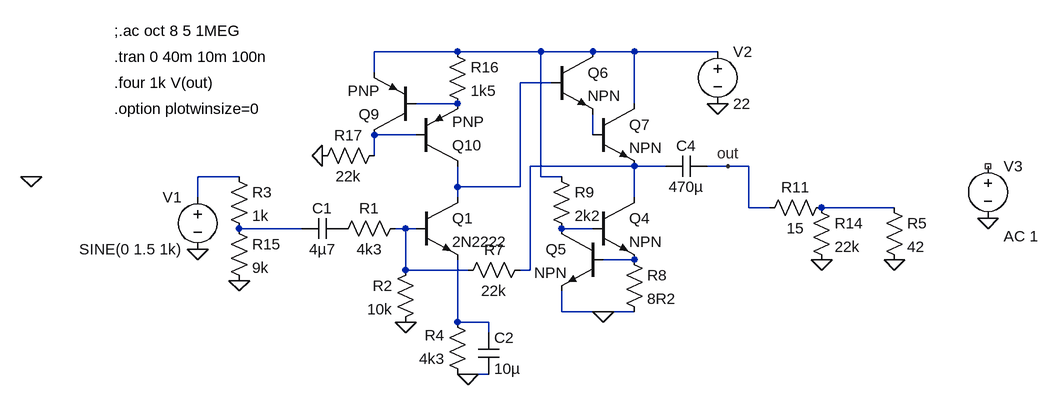
[diagram p0: schematic self_vas_2.asc]
self_vas_2.asc, the LTspice schematic file:
Version 4
SHEET 1 2004 740
WIRE 720 -16 592 -16
WIRE 848 -16 720 -16
WIRE 928 -16 848 -16
WIRE 992 -16 928 -16
WIRE 1120 -16 992 -16
WIRE 592 16 592 -16
WIRE 864 32 816 32
WIRE 720 64 656 64
WIRE 992 64 992 -16
WIRE 656 112 592 112
WIRE 928 112 928 80
WIRE 592 144 592 112
WIRE 992 160 832 160
WIRE 1040 160 992 160
WIRE 1136 160 1104 160
WIRE 1168 160 1136 160
WIRE 384 176 320 176
WIRE 848 176 848 -16
WIRE 880 176 848 176
WIRE 720 192 720 160
WIRE 816 192 816 32
WIRE 816 192 720 192
WIRE 320 208 320 176
WIRE 720 208 720 192
WIRE 992 208 992 160
WIRE 1168 224 1168 160
WIRE 1200 224 1168 224
WIRE 1392 224 1280 224
WIRE 480 256 384 256
WIRE 640 256 624 256
WIRE 656 256 640 256
WIRE 928 256 880 256
WIRE 992 304 944 304
WIRE 640 320 640 256
WIRE 736 320 640 320
WIRE 832 320 832 160
WIRE 832 320 816 320
WIRE 880 384 880 352
WIRE 944 384 880 384
WIRE 992 384 944 384
WIRE 720 400 720 304
WIRE 768 400 720 400
WIRE 768 416 768 400
WIRE 736 480 720 480
WIRE 768 480 736 480
FLAG 320 288 0
FLAG 640 400 0
FLAG 736 480 0
FLAG 1120 64 0
FLAG 944 384 0
FLAG 1280 304 0
FLAG 384 336 0
FLAG 1536 240 0
FLAG 512 144 0
FLAG 64 176 0
FLAG 1392 304 0
FLAG 1136 160 out
SYMBOL voltage 320 192 M0
WINDOW 123 0 0 Left 0
WINDOW 39 24 124 Left 2
SYMATTR InstName V1
SYMATTR Value SINE(0 1.5 1k)
SYMBOL cap 544 240 R90
WINDOW 0 0 32 VBottom 2
WINDOW 3 32 32 VTop 2
SYMATTR InstName C1
SYMATTR Value 4µ7
SYMBOL res 640 240 R90
WINDOW 0 0 56 VBottom 2
WINDOW 3 32 56 VTop 2
SYMATTR InstName R1
SYMATTR Value 4k3
SYMBOL cap 752 416 R0
SYMATTR InstName C2
SYMATTR Value 10µ
SYMBOL res 656 304 M0
SYMATTR InstName R2
SYMATTR Value 10k
SYMBOL res 368 160 R0
SYMATTR InstName R3
SYMATTR Value 1k
SYMBOL npn 656 208 R0
SYMATTR InstName Q1
SYMATTR Value 2N2222
SYMBOL res 736 496 R180
WINDOW 0 36 76 Left 2
WINDOW 3 36 40 Left 2
SYMATTR InstName R4
SYMATTR Value 4k3
SYMBOL res 832 304 R90
WINDOW 0 0 56 VBottom 2
WINDOW 3 32 56 VTop 2
SYMATTR InstName R7
SYMATTR Value 22k
SYMBOL voltage 1120 -32 R0
WINDOW 123 0 0 Left 0
WINDOW 39 24 44 Left 2
SYMATTR InstName V2
SYMATTR Value 22
SYMBOL npn 928 208 R0
SYMATTR InstName Q4
SYMBOL npn 944 256 M0
SYMATTR InstName Q5
SYMBOL res 976 288 R0
SYMATTR InstName R8
SYMATTR Value 8R2
SYMBOL res 864 160 R0
SYMATTR InstName R9
SYMATTR Value 2k2
SYMBOL cap 1104 144 R90
WINDOW 0 0 32 VBottom 2
WINDOW 3 32 32 VTop 2
SYMATTR InstName C4
SYMATTR Value 470µ
SYMBOL npn 864 -16 R0
SYMATTR InstName Q6
SYMBOL res 1296 208 R90
WINDOW 0 0 56 VBottom 2
WINDOW 3 32 56 VTop 2
SYMATTR InstName R11
SYMATTR Value 15
SYMBOL npn 928 64 R0
SYMATTR InstName Q7
SYMBOL res 1264 208 R0
SYMATTR InstName R14
SYMATTR Value 22k
SYMBOL res 368 240 R0
SYMATTR InstName R15
SYMATTR Value 9k
SYMBOL voltage 1536 144 R0
WINDOW 123 24 124 Left 2
WINDOW 39 0 0 Left 0
SYMATTR Value2 AC 1
SYMATTR InstName V3
SYMATTR Value ""
SYMBOL pnp 656 112 R180
SYMATTR InstName Q9
SYMBOL pnp 656 160 M180
SYMATTR InstName Q10
SYMBOL res 704 -32 R0
SYMATTR InstName R16
SYMATTR Value 1k5
SYMBOL res 608 128 R90
WINDOW 0 0 56 VBottom 2
WINDOW 3 32 56 VTop 2
SYMATTR InstName R17
SYMATTR Value 22k
SYMBOL res 1376 208 R0
SYMATTR InstName R5
SYMATTR Value 42
TEXT 192 -8 Left 2 !.tran 0 40m 10m 100n
TEXT 192 32 Left 2 !.four 1k V(out)
TEXT 192 72 Left 2 !.option plotwinsize=0
TEXT 192 -48 Left 2 !;.ac oct 8 5 1MEG

The netlist it stands for:
* self_vas_2.asc
V1 N007 0 SINE(0 1.5 1k)
C1 P001 N009 4µ7
R1 N010 P001 4k3
C2 N013 0 10µ
R2 N010 0 10k
R3 N007 N009 1k
Q1 N002 N010 N013 0 2N2222
R4 0 N013 4k3
R7 N006 N010 22k
V2 N001 0 22
Q4 N006 N011 N012 0 NPN
Q5 N011 N012 0 0 NPN
R8 N012 0 8R2
R9 N001 N011 2k2
C4 out N006 470µ
Q6 N001 N002 N005 0 NPN
R11 N008 out 15
Q7 N001 N005 N006 0 NPN
R14 N008 0 22k
R15 N009 0 9k
V3 NC_01 0 AC 1
Q9 N004 N003 N001 0 PNP
Q10 N002 N004 N003 0 PNP
R16 N001 N003 1k5
R17 N004 0 22k
R5 N008 0 42
.model NPN NPN
.model PNP PNP
.lib standard.bjt
.tran 0 40m 10m 100n
.four 1k V(out)
.option plotwinsize=0
;.ac oct 8 5 1MEG
.backanno
.end